# Altium project IMUCubeCTRL.PrjPCB
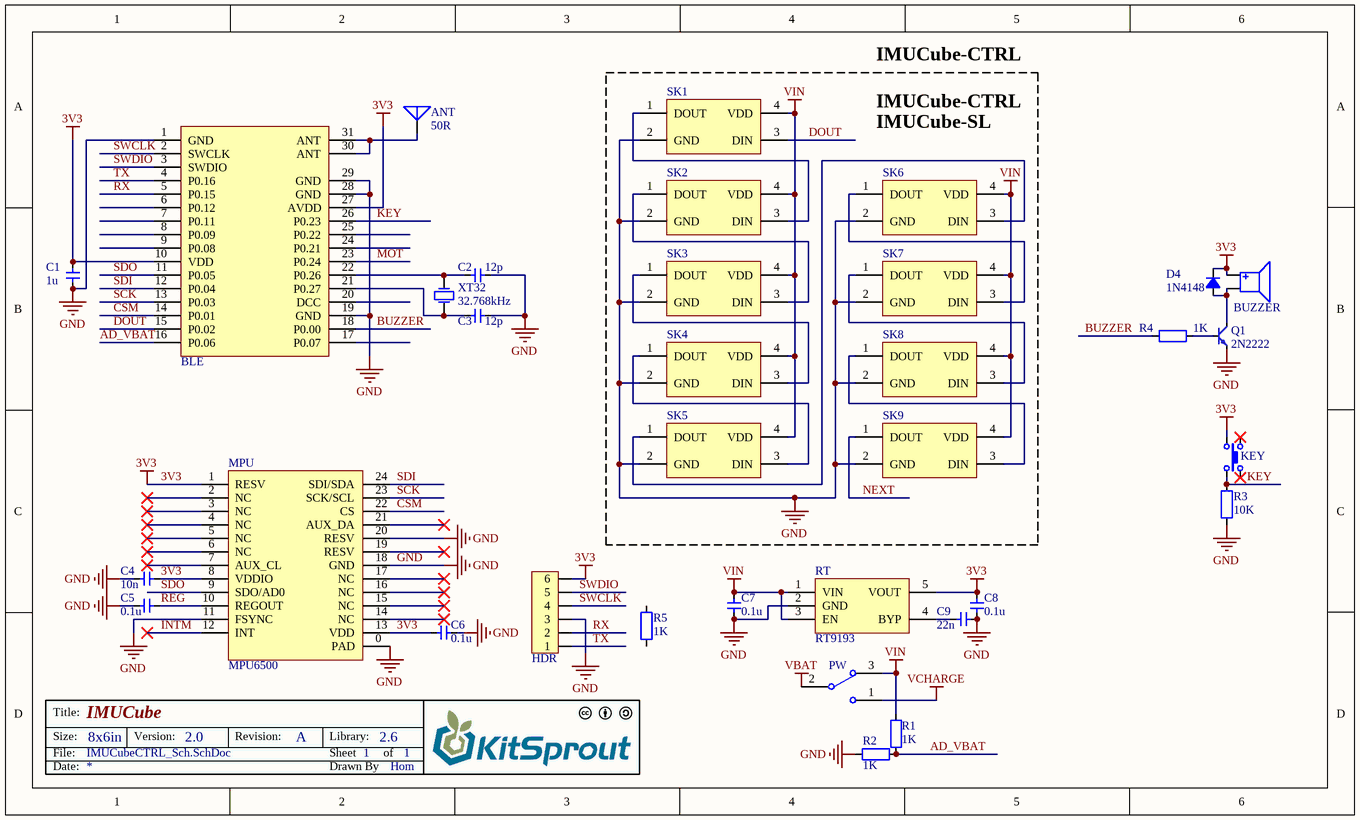
[diagram p0: IMUCubeCTRL_Sch.SchDoc]
1 sheet, 34 parts. Net scope: global (net labels, ports and power ports of the same name join across sheets).
Board file: IMUCubeCTRL_Pcb.PcbDoc

## Sheet IMUCubeCTRL_Sch.SchDoc: IMUCube
size 254 x 152 mm; Author: Hom; CompanyName: KitSprout; DrawnBy: Hom; Engineer: Hom; Organization: KitSprout; Revision: A; SheetNumber: 1; SheetTotal: 1; Version: 2.0; LibVersion: 2.6; PageSetup: Record=PageOptions|CenterHorizontal=True|CenterVertical=True|PrintScale=1.36|XCorrection=1.00|YCorrection=1.00|PrintKind=0|BorderSize=5000000|LeftOffset=0|BottomOffset=0|Orientation=2|PaperLength=1000|PaperWidth=1000|Scale=100|PaperSource=7|PrintQuality=-3|MediaType=1|DitherType=10|PrintScaleMode=1|PaperKind=A4|PaperIndex=9

### Parts
ANT  value 50R  [ANT_2.4G_3.2x1.6]  (hidden comment: Ant_2.4G)
BLE  MDBT40 nano  [MDBT40 nano]  (value not drawn)
BUZZER  Buzzer  [Buzzer_5x5]  (value not drawn)
C1  value 1u  [CAP_0402]  (hidden comment: Cap_0402)
C2  value 12p  [CAP_0402]  (hidden comment: Cap_0402)
C3  value 12p  [CAP_0402]  (hidden comment: Cap_0402)
C4  value 10n  [CAP_0402]  (hidden comment: Cap_0402)
C5  value 0.1u  [CAP_0402]  (hidden comment: Cap_0402)
C6  value 0.1u  [CAP_0402]  (hidden comment: Cap_0402)
C7  value 0.1u  [CAP_0402]  (hidden comment: Cap_0402)
C8  value 0.1u  [CAP_0402]  (hidden comment: Cap_0402)
C9  value 22n  [CAP_0402]  (hidden comment: Cap_0402)
D4  value 1N4148  [SOD-323]  (hidden comment: Diode_SOD323)
HDR  HDR1x6_1.27  [HDR1X6_1.27_180HFD]  (value not drawn)
KEY  ButtonTACT  [ButtonTACT_3.5*3.55_90]  (value not drawn)
MPU  MPU6500  [QFN_P0.4_24]
PW  SwitchSPDT_2.8x6.6_90  [SwitchSPDT_2.8X6.6_90]  (value not drawn)
Q1  value 2N2222  [SOT23-3]  (hidden comment: BJT_NPN)
R1  value 1K  [RES_0402]  (hidden comment: Res_0402)
R2  value 1K  [RES_0402]  (hidden comment: Res_0402)
R3  value 10K  [RES_0603]  (hidden comment: Res_0603)
R4  value 1K  [RES_0603]  (hidden comment: Res_0603)
R5  value 1K  [RES_0402]  (hidden comment: Res_0402)
RT  RT9193  [SOT23-5]
SK1  LED_3535_SK6812  [LED_3535_4P]  (value not drawn)
SK2  LED_3535_SK6812  [LED_3535_4P]  (value not drawn)
SK3  LED_3535_SK6812  [LED_3535_4P]  (value not drawn)
SK4  LED_3535_SK6812  [LED_3535_4P]  (value not drawn)
SK5  LED_3535_SK6812  [LED_3535_4P]  (value not drawn)
SK6  LED_3535_SK6812  [LED_3535_4P]  (value not drawn)
SK7  LED_3535_SK6812  [LED_3535_4P]  (value not drawn)
SK8  LED_3535_SK6812  [LED_3535_4P]  (value not drawn)
SK9  LED_3535_SK6812  [LED_3535_4P]  (value not drawn)
XT32  value 32.768kHz  [XT_2012_2]  (hidden comment: XTAL_32.768kHz)

### Nets
3V3: BLE.10(VDD) BLE.27(AVDD) BUZZER.P(Positive) C1.2 C4.2 C6.2 C8.1 D4.2(K) HDR.6 KEY.3 MPU.1(RESV) MPU.8(VDDIO) MPU.13(VDD) RT.5(VOUT)
GND: BLE.1(GND) BLE.19(GND) BLE.28(GND) BLE.29(GND) C1.1 C2.2 C3.2 C4.1 C5.1 C6.1 C7.2 C8.2 C9.2 HDR.3 MPU.0(PAD) MPU.11(FSYNC) MPU.18(GND) MPU.20(RESV) Q1.2(E) R2.1 R3.1 RT.2(GND) SK1.2(GND) SK2.2(GND) SK3.2(GND) SK4.2(GND) SK5.2(GND) SK6.2(GND) SK7.2(GND) SK8.2(GND) SK9.2(GND)
VBAT: PW.2
VCHARGE: PW.1
VIN: C7.1 PW.3 R1.1 RT.1(VIN) RT.3(EN) SK1.4(VDD) SK2.4(VDD) SK3.4(VDD) SK4.4(VDD) SK5.4(VDD) SK6.4(VDD) SK7.4(VDD) SK8.4(VDD) SK9.4(VDD)
AD_VBAT: BLE.16(P0.06) R1.2 R2.2
BUZZER: BLE.18(P0.00) R4.2
CSM: BLE.14(P0.01) MPU.22(CS)
DOUT: BLE.15(P0.02) SK1.3(DIN)
INTM: MPU.12(INT)
KEY: BLE.26(P0.23) KEY.4 R3.2
MOT: BLE.23(P0.24)
NEXT: SK9.1(DOUT)
REG: C5.2 MPU.10(REGOUT)
RX: BLE.5(P0.15) HDR.2
SCK: BLE.13(P0.03) MPU.23(SCK/SCL)
SDI: BLE.12(P0.04) MPU.24(SDI/SDA)
SDO: BLE.11(P0.05) MPU.9(SDO/AD0)
SWCLK: BLE.2(SWCLK) HDR.4
SWDIO: BLE.3(SWDIO) HDR.5
TX: BLE.4(P0.16) HDR.1
NetANT_1: ANT.1(A) BLE.30(ANT) BLE.31(ANT)
NetBLE_21: BLE.21(P0.27) C3.1 XT32.1(OSC1)
NetBLE_22: BLE.22(P0.26) C2.1 XT32.2(OSC2)
NetBUZZER_N: BUZZER.N(Negative) D4.1(A) Q1.3(C)
NetC9_1: C9.1 RT.4(BYP)
NetQ1_1: Q1.1(B) R4.1
NetSK1_1: SK1.1(DOUT) SK2.3(DIN)
NetSK2_1: SK2.1(DOUT) SK3.3(DIN)
NetSK3_1: SK3.1(DOUT) SK4.3(DIN)
NetSK4_1: SK4.1(DOUT) SK5.3(DIN)
NetSK5_1: SK5.1(DOUT) SK6.3(DIN)
NetSK6_1: SK6.1(DOUT) SK7.3(DIN)
NetSK7_1: SK7.1(DOUT) SK8.3(DIN)
NetSK8_1: SK8.1(DOUT) SK9.3(DIN)

Not connected (* = marked no-connect by the designer): BLE 6(P0.12) 7(P0.11) 8(P0.09) 9(P0.08) 17(P0.07) 20(DCC) 24(P0.21) 25(P0.22); KEY 1* 2*; MPU 2(NC)* 3(NC)* 4(NC)* 5(NC)* 6(NC)* 7(AUX_CL)* 14(NC)* 15(NC)* 16(NC)* 17(NC)* 19(RESV)* 21(AUX_DA)*; R5 1 2

### Notes on the sheet
- IMUCube-CTRL
- IMUCube-SL
- Title:
- Size:
- Date:
- File:
- 8x6in
- Version:
- Revision:
- Sheet
- Drawn By
- Library:
- of

### Library data of the parts
ANT = Ant_2.4G: Antenna
BLE = MDBT40 nano: Module
C1-C9 = Cap_0402: Capacitor
D4 = Diode_SOD323: Diode
HDR = HDR1x6_1.27: Header
KEY = ButtonTACT: Button
MPU = MPU925x: Sensor Motion
PW = SwitchSPDT_2.8x6.6_90: Switch
Q1 = BJT_NPN: Transistor
R1 R2 R5 = Res_0402: Resistor
R3 R4 = Res_0603: Resistor
RT = RT9193: Power
SK1-SK9 = LED_3535_SK6812: LED
XT32 = XTAL_32.768k: Crystal Oscillator